# Altium schematic sheet Xbee.SchDoc
size A
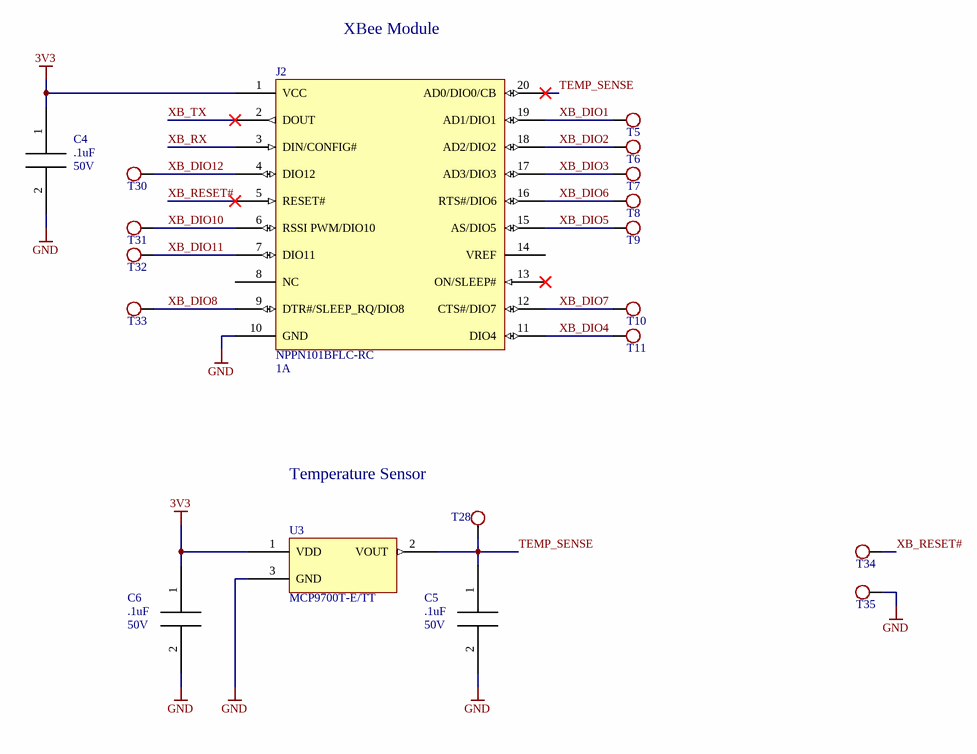
[diagram p0: Xbee.SchDoc]

## Parts
C4  value .1uF  Rating: 50V  [0603]  (hidden comment: *)
C5  value .1uF  Rating: 50V  [0603]  (hidden comment: *)
C6  value .1uF  Rating: 50V  [0603]  (hidden comment: *)
J2  Rating: 1A  [NPPN101BFLC-RC]  (hidden comment: J_XBEE_NPPN101BFLC-RC)
T5  TESTPOINT  [TESTPOINT1MM]  (value not drawn)
T6  TESTPOINT  [TESTPOINT1MM]  (value not drawn)
T7  TESTPOINT  [TESTPOINT1MM]  (value not drawn)
T8  TESTPOINT  [TESTPOINT1MM]  (value not drawn)
T9  TESTPOINT  [TESTPOINT1MM]  (value not drawn)
T10  TESTPOINT  [TESTPOINT1MM]  (value not drawn)
T11  TESTPOINT  [TESTPOINT1MM]  (value not drawn)
T28  TESTPOINT  [TESTPOINT1MM]  (value not drawn)
T30  TESTPOINT  [TESTPOINT1MM]  (value not drawn)
T31  TESTPOINT  [TESTPOINT1MM]  (value not drawn)
T32  TESTPOINT  [TESTPOINT1MM]  (value not drawn)
T33  TESTPOINT  [TESTPOINT1MM]  (value not drawn)
T34  TESTPOINT  [TESTPOINT1MM]  (value not drawn)
T35  TESTPOINT  [TESTPOINT1MM]  (value not drawn)
U3  PartNumber: MCP9700T-E/TT  [TO92]  (hidden comment: U_TEMPSENSE-AN_TO92)

## Nets
3V3: C4.1 C6.1 J2.1(VCC) U3.1(VDD)
GND: C4.2 C5.2 C6.2 J2.10(GND) T35.1 U3.3(GND)
TEMP_SENSE: C5.1 J2.20(AD0/DIO0/CB) T28.1 U3.2(VOUT)
XB_DIO1: J2.19(AD1/DIO1) T5.1
XB_DIO2: J2.18(AD2/DIO2) T6.1
XB_DIO3: J2.17(AD3/DIO3) T7.1
XB_DIO4: J2.11(DIO4) T11.1
XB_DIO5: J2.15(AS/DIO5) T9.1
XB_DIO6: J2.16(RTS#/DIO6) T8.1
XB_DIO7: J2.12(CTS#/DIO7) T10.1
XB_DIO8: J2.9(DTR#/SLEEP_RQ/DIO8) T33.1
XB_DIO10: J2.6(RSSI_PWM/DIO10) T31.1
XB_DIO11: J2.7(DIO11) T32.1
XB_DIO12: J2.4(DIO12) T30.1
XB_RESET#: J2.5(RESET#) T34.1
XB_RX: J2.3(DIN/CONFIG#)
XB_TX: J2.2(DOUT)

Not connected (* = marked no-connect by the designer): J2 8(NC) 13(ON/SLEEP#)* 14(VREF)

## Notes on the sheet
- XBee Module
- Temperature Sensor

## Library data of the parts
C4-C6 = C_CAP_0603: PartNumber: C0603C104K5RACAUTO; Manufacturer: KEMET
J2 = J_XBEE_NPPN101BFLC-RC: Manufacturer: Sullins Connector Solutions; PartNumber: NPPN101BFLC-RC
T5-T11 T28 T30-T35 = T_TESTPOINT_TESTPOINT1MM: Value: 1mm
U3 = U_TEMPSENSE-AN_TO92: Manufacturer: Microchip